# EAGLE design Naninator and Badger (EAGLE 6.2)
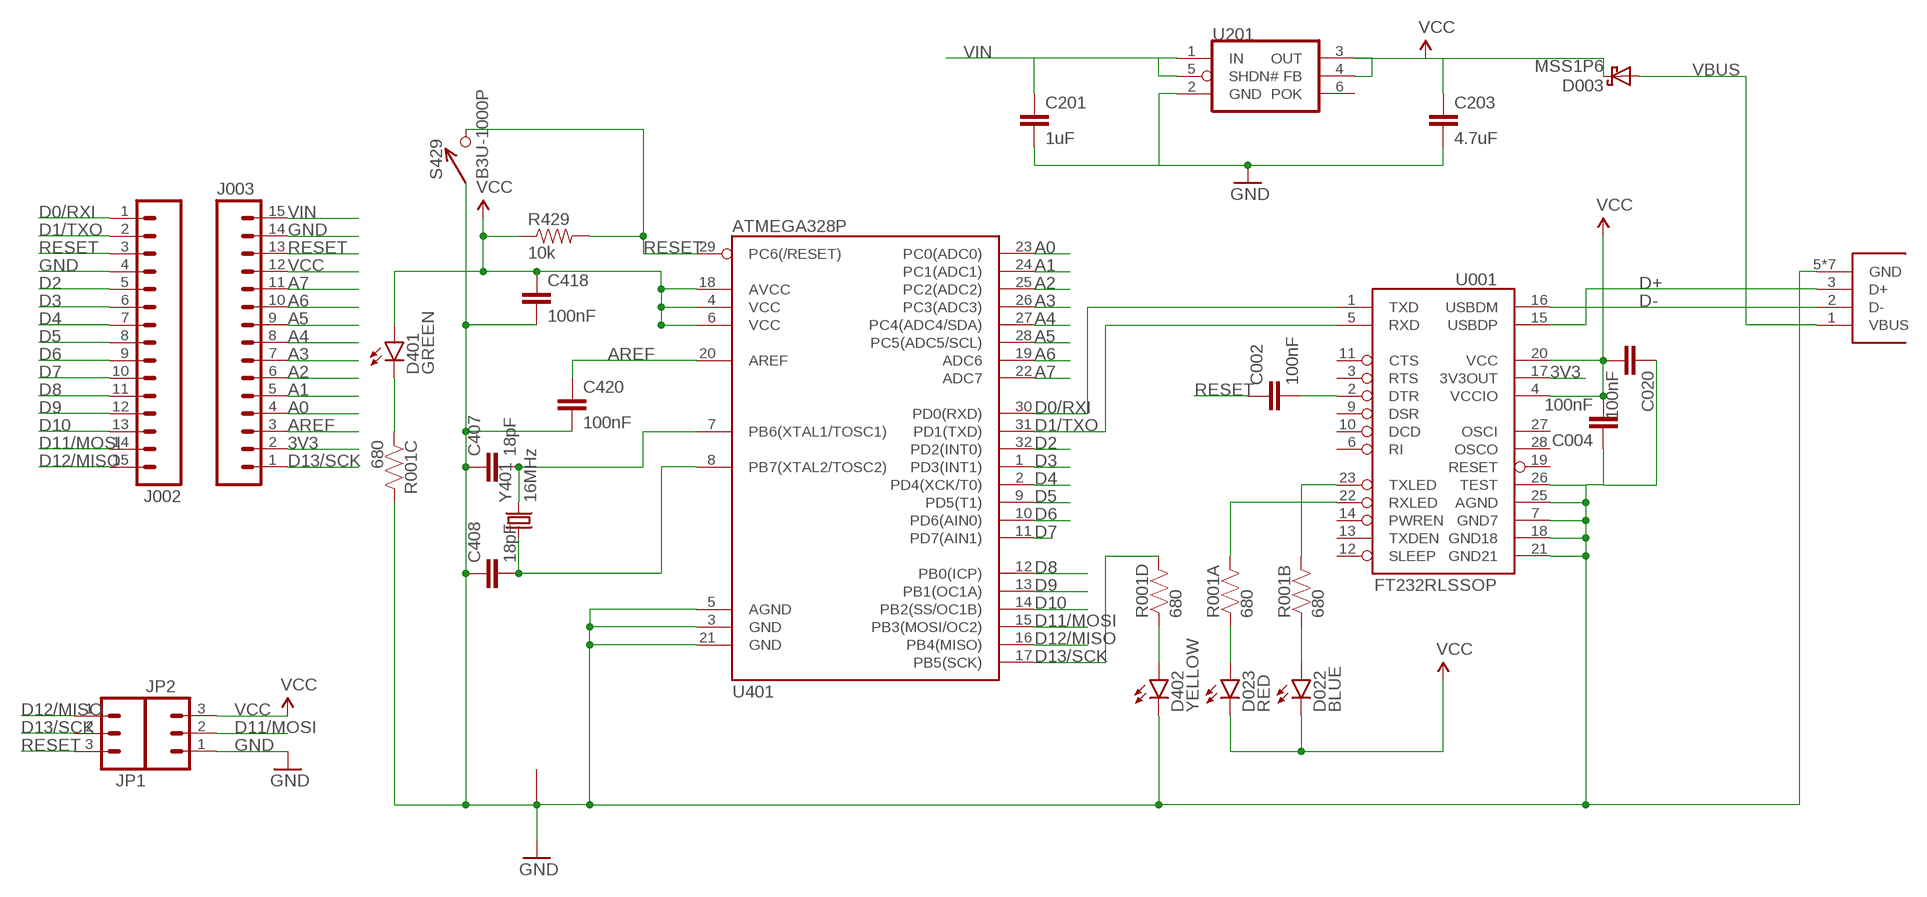
[diagram p0: schematic, sheet 1]

## Parts
C002  100nF  CAP0402-CAP  [0402-CAP]
C004  100nF  CAP0402-CAP  [0402-CAP]
C020  100nF  CAP0402-CAP  [0402-CAP]
C201  1uF  CAP0402-CAP  [0402-CAP]
C203  4.7uF  CAP0402-CAP  [0402-CAP]
C407  18pF  CAP0402-CAP  [0402-CAP]
C408  18pF  CAP0402-CAP  [0402-CAP]
C418  100nF  CAP0402-CAP  [0402-CAP]
C420  100nF  CAP0402-CAP  [0402-CAP]
D003  MSS1P6  [MICROSMP]
D022  BLUE  LED0603  [LED-0603]
D023  RED  LED0603  [LED-0603]
D401  GREEN  LED0603  [LED-0603]
D402  YELLOW  LED0603  [LED-0603]
J001  USB_MICROB_JSTFCI  [USB-MICROB-CONN-09505]
J002  M15  [1X15]
J003  M15  [1X15]
JP1  M03PTH  [1X03]
JP2  M03PTH  [1X03]
R001  680  RP404  [CRA04]
R429  10k  RESISTOR0402-RES  [0402-RES]
S429  B3U-1000P  [B3U-1000P]
U001  FT232RLSSOP  [SSOP28DB@1]
U201  MAX8881  [SOT-23-6]
U401  ATMEGA328P  ATMEGA168  [TQFP32-08@1]
Y401  16MHz  CX2520  [CRYSTAL_SMD_2MM_2_5MM]

## Nets
3V3: J003.2 U001.17(3V3OUT)
A0: J003.4 U401.23(PC0(ADC0))
A1: J003.5 U401.24(PC1(ADC1))
A2: J003.6 U401.25(PC2(ADC2))
A3: J003.7 U401.26(PC3(ADC3))
A4: J003.8 U401.27(PC4(ADC4/SDA))
A5: J003.9 U401.28(PC5(ADC5/SCL))
A6: J003.10 U401.19(ADC6)
A7: J003.11 U401.22(ADC7)
AREF: C420.1 J003.3 U401.20(AREF)
D0/RXI: J002.1 U001.1(TXD) U401.30(PD0(RXD))
D1/TXO: J002.2 U001.5(RXD) U401.31(PD1(TXD))
D2: J002.5 U401.32(PD2(INT0))
D3: J002.6 U401.1(PD3(INT1))
D4: J002.7 U401.2(PD4(XCK/T0))
D5: J002.8 U401.9(PD5(T1))
D6: J002.9 U401.10(PD6(AIN0))
D7: J002.10 U401.11(PD7(AIN1))
D8: J002.11 U401.12(PB0(ICP))
D9: J002.12 U401.13(PB1(OC1A))
D10: J002.13 U401.14(PB2(SS/OC1B))
D11/MOSI: J002.14 JP2.2 U401.15(PB3(MOSI/OC2))
D12/MISO: J002.15 JP1.1 U401.16(PB4(MISO))
D13/SCK: J003.1 JP1.2 R001.5 U401.17(PB5(SCK))
D+: J001.3(D+) U001.15(USBDP)
D-: J001.2(D-) U001.16(USBDM)
DTR#: C002.2 U001.2(DTR)
GND: C004.1 C020.1 C201.2 C203.2 C407.1 C408.1 C418.2 C420.2 D402.C J001.5(GND) J001.P1(GND) J001.P2(GND) J001.P3(GND) J001.P4(GND) J001.P5(GND) J001.P6(GND) J002.4 J003.14 JP2.1 R001.6 S429.P$1 U001.7(GND7) U001.18(GND18) U001.21(GND21) U001.25(AGND) U001.26(TEST) U201.2(GND) U401.3(GND) U401.5(AGND) U401.21(GND) Y401.2 Y401.4
N$1: C407.2 U401.7(PB6(XTAL1/TOSC1)) Y401.3
N$2: C408.2 U401.8(PB7(XTAL2/TOSC2)) Y401.1
N$3: D401.C R001.3
N$4: D022.A R001.2
N$5: D023.A R001.1
N$8: D402.A R001.4
RESET: C002.1 J002.3 J003.13 JP1.3 R429.2 S429.P$2 U401.29(PC6(/RESET))
RXLED1: R001.8 U001.22(RXLED)
TXLED1: R001.7 U001.23(TXLED)
VBUS: D003.A J001.1(VBUS)
VCC: C004.2 C020.2 C203.1 C418.1 D003.K D022.C D023.C D401.A J003.12 JP2.3 R429.1 U001.4(VCCIO) U001.20(VCC) U201.3(OUT) U201.4(FB) U401.4(VCC) U401.6(VCC) U401.18(AVCC)
VIN: C201.1 J003.15 U201.1(IN) U201.5(SHDN#)
Unconnected: U001.3(RTS) U001.6(RI) U001.9(DSR) U001.10(DCD) U001.11(CTS) U001.12(SLEEP) U001.13(TXDEN) U001.14(PWREN) U001.19(RESET) U001.27(OSCI) U001.28(OSCO) U201.6(POK)

## Library data of the parts
C002 C004 C020 C418 C420 = SparkFun:CAP: Capacitor Standard 0603 ceramic capacitor, and 0.1" leaded capacitor.; DIGIKEY: 445-1268-1-ND
C201 = SparkFun:CAP: Capacitor Standard 0603 ceramic capacitor, and 0.1" leaded capacitor.; DIGIKEY: 445-1415-1-ND
C203 = SparkFun:CAP: Capacitor Standard 0603 ceramic capacitor, and 0.1" leaded capacitor.; DIGIKEY: 445-7395-1-ND
C407 C408 = SparkFun:CAP: Capacitor Standard 0603 ceramic capacitor, and 0.1" leaded capacitor.; DIGIKEY: 445-1238-1-ND
D003 = KwanSystems:MSS1P6; DIGIKEY: MSS1P6-M3/89AGICT-ND
D022 = SparkFun-LED:LED: LEDs Standard schematic elements and footprints for 5mm, 3mm, 1206, and 0603 sized LEDs. 5mm - Spark Fun Electronics SKU : COM-00529 (and others); DIGIKEY: 350-2037-1-ND
D023 = SparkFun-LED:LED: LEDs Standard schematic elements and footprints for 5mm, 3mm, 1206, and 0603 sized LEDs. 5mm - Spark Fun Electronics SKU : COM-00529 (and others); DIGIKEY: 754-1359-1-ND
D401 = SparkFun-LED:LED: LEDs Standard schematic elements and footprints for 5mm, 3mm, 1206, and 0603 sized LEDs. 5mm - Spark Fun Electronics SKU : COM-00529 (and others); DIGIKEY: 350-2036-1-ND
D402 = SparkFun-LED:LED: LEDs Standard schematic elements and footprints for 5mm, 3mm, 1206, and 0603 sized LEDs. 5mm - Spark Fun Electronics SKU : COM-00529 (and others); DIGIKEY: 754-1124-1-ND
J001 = KwanSystems:USB_MICROB_JST; DIGIKEY: 455-2562-1-ND
J002 J003 = SparkFun-Connectors:M15: Header 15 Standard 15-pin 0.1" header. Use with straight break away headers (SKU : PRT-00116), right angle break away headers (PRT-00553), swiss pins (PRT-00743), machine pins (PRT-00117), and female headers (PRT-00115).; DIGIKEY: $NOPART
JP1 JP2 = SparkFun-Connectors:M03: Header 3 Standard 3-pin 0.1" header. Use with straight break away headers (SKU : PRT-00116), right angle break away headers (PRT-00553), swiss pins (PRT-00743), machine pins (PRT-00117), and female headers (PRT-00115). Molex polarized connector foot print use with SKU : PRT-08232 with associated crimp pins and housings.; DIGIKEY: $NOPART
R001 = KwanSystems:RP4; DIGIKEY: CRA4S8680CT-ND
R429 = SparkFun-Passives:RESISTOR: Resistor Basic schematic elements and footprints for 0603, 1206, and PTH resistors.; DIGIKEY: P10.0KLCT-ND
S429 = KwanSystems:B3U-1000P
U001 = SparkFun-DigitalIC:FT232RL: USB UART FT232RL 4th Generation USB UART (USB <-> Serial) Controller. Spark Fun Electronics SKU : COM-00650; DIGIKEY: 768-1007-1-ND
U201 = KwanSystems:MAX8881; DIGIKEY: MAX8881EUT50+TCT-ND
U401 = SparkFun-DigitalIC:ATMEGA168: Atmel 32-pin 8-bit micro, 16k flash.; DIGIKEY: ATMEGA328P-15AZCT-ND
Y401 = KwanSystems:CX2520; DIGIKEY: 478-6955-1-ND

## Net classes
0 default: width 0.152 mm, drill 0.33 mm, clearance 0.152 mm

## Board
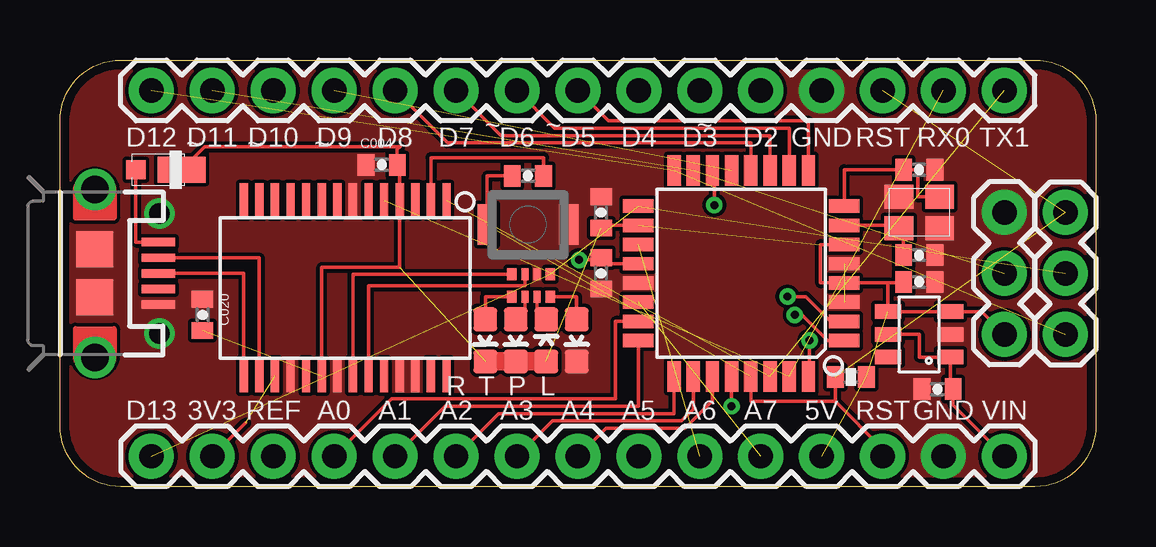
[diagram p1: board, top side]
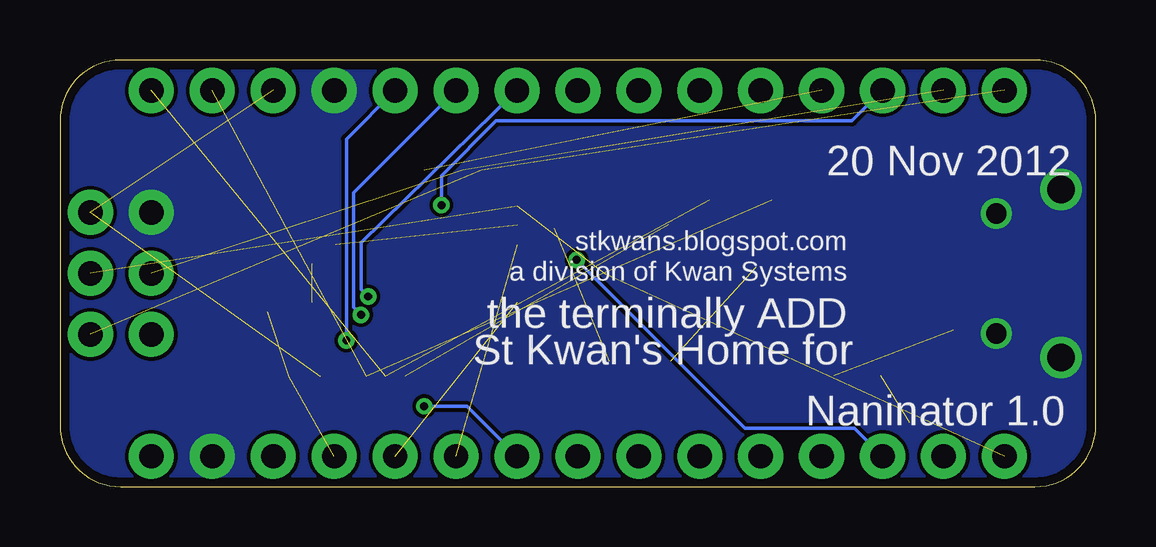
[diagram p2: board, bottom side, seen from below]

Size 43.18 x 17.78 mm. Coordinates in mm from the lower left corner, seen from the top.
Outline: 2.54,17.78 40.64,17.78 arc-90 43.18,15.24 43.18,2.54 arc-90 40.64,0 2.54,0 arc-90 0,2.54 0,15.24 arc-90 2.54,17.78
Copper layers (1*16): Top 0.0356mm / dielectric 1.5011mm / Bottom 0.0356mm
Design rules: minimum track width 6mil, minimum drill 13mil, track to track 6mil, track to pad 6mil, pad to pad 6mil, via to via 6mil, smd to smd 6mil, copper to edge 15mil, drill to drill 6mil, minimum pad ring 7mil, minimum via ring 7mil, stop-mask expansion 4mil, vias tented up to drill 14mil, thermal gap 10mil

### Footprints (pad centres in the part's own frame; a part is rotated, then mirrored left to right if it is on the bottom)
0402-CAP = smd 0.7 x 0.9: 1 -0.65,0; 2 0.65,0
MICROSMP = smd 0.8 x 0.8: A 0.9,0 | smd 2 x 1.1: K -1,0
LED-0603 = smd 1 x 1: A 0,-0.877; C 0,0.877
USB-MICROB-CONN-09505 = smd 0.35 x 1.4: 1 -1.3,4.1; 2 -0.65,4.1; 3 0,4.1; 4 0.65,4.1; 5 1.3,4.1 | smd 1.5 x 1.55: P1 -1,1.45; P2 1,1.45 | drill 1.15 pad 1.422: P3 -3.5,1.45; P4 3.5,1.45 | drill 0.85 pad 1.27: P5 -2.5,4.15; P6 2.5,4.15
1X15 = drill 1.016 pad 1.88: 1 0,0; 2 2.54,0; 3 5.08,0; 4 7.62,0; 5 10.16,0; 6 12.7,0; 7 15.24,0; 8 17.78,0; 9 20.32,0; 10 22.86,0; 11 25.4,0; 12 27.94,0; 13 30.48,0; 14 33.02,0; 15 35.56,0
1X03 = drill 1.016 pad 1.88: 1 0,0; 2 2.54,0; 3 5.08,0
CRA04 = smd 0.4 x 0.5: 1 -0.8,-0.475; 4 0.8,-0.475; 5 0.8,0.475; 8 -0.8,0.475 | smd 0.3 x 0.5: 2 -0.25,-0.475; 3 0.25,-0.475; 6 0.25,0.475; 7 -0.25,0.475
0402-RES = smd 0.7 x 0.9: 1 -0.65,0; 2 0.65,0
B3U-1000P = smd 0.8 x 1.7: P$1 -1.7,0; P$2 1.7,0
SSOP28DB = smd 0.348 x 1.397: 1 -4.225,-3.656; 2 -3.575,-3.656; 3 -2.925,-3.656; 4 -2.275,-3.656; 5 -1.625,-3.656; 6 -0.975,-3.656; 7 -0.325,-3.656; 8 0.325,-3.656; 9 0.975,-3.656; 10 1.625,-3.656; 11 2.275,-3.656; 12 2.925,-3.656; 13 3.575,-3.656; 14 4.225,-3.656; 15 4.225,3.656; 16 3.575,3.656; 17 2.925,3.656; 18 2.275,3.656; 19 1.625,3.656; 20 0.975,3.656; 21 0.325,3.656; 22 -0.325,3.656; 23 -0.975,3.656; 24 -1.625,3.656; 25 -2.275,3.656; 26 -2.925,3.656; 27 -3.575,3.656; 28 -4.225,3.656
SOT-23-6 = smd 0.6 x 1.1: 1 -0.95,-1.3; 2 0,-1.3; 3 0.95,-1.3; 4 0.95,1.3; 5 0,1.3; 6 -0.95,1.3
TQFP32-08 = smd 1.27 x 0.559: 1 -4.293,2.8; 2 -4.293,2; 3 -4.293,1.2; 4 -4.293,0.4; 5 -4.293,-0.4; 6 -4.293,-1.2; 7 -4.293,-2; 8 -4.293,-2.8; 17 4.293,-2.8; 18 4.293,-2; 19 4.293,-1.2; 20 4.293,-0.4; 21 4.293,0.4; 22 4.293,1.2; 23 4.293,2; 24 4.293,2.8 | smd 0.559 x 1.27: 9 -2.8,-4.293; 10 -2,-4.293; 11 -1.2,-4.293; 12 -0.4,-4.293; 13 0.4,-4.293; 14 1.2,-4.293; 15 2,-4.293; 16 2.8,-4.293; 25 2.8,4.293; 26 2,4.293; 27 1.2,4.293; 28 0.4,4.293; 29 -0.4,4.293; 30 -1.2,4.293; 31 -2,4.293; 32 -2.8,4.293
CRYSTAL_SMD_2MM_2_5MM = smd 1.2 x 1: 1 -0.85,-0.65; 2 0.85,-0.65; 3 0.85,0.65; 4 -0.85,0.65

### Placement (x,y rotation side)
C002  19.51,12.95 0 top
C004  13.41,13.41 0 top
C020  5.94,7.16 270 top
C201  36.58,4.06 180 top
C203  35.81,8.53 0 top
C407  35.81,9.65 180 top
C408  35.81,13.21 180 top
C418  22.56,11.43 90 top
C420  22.56,8.89 270 top
D003  4.06,13.21 180 top
D022  19,6.1 180 top
D023  17.73,6.1 180 top
D401  20.27,6.1 0 top
D402  21.54,6.1 180 top
J001  0,8.89 270 top
J002  39.37,16.51 180 top
J003  3.81,1.27 0 top
JP1  41.91,6.35 90 top
JP2  39.37,11.43 270 top
R001  19.63,8.38 0 top
R429  32.97,4.57 180 top
S429  19.51,10.92 180 top
U001  FT232RLSSOP  [SSOP28DB]  11.89,8.28 180 top
U201  35.81,6.35 90 top
U401  ATMEGA328P  [TQFP32-08]  28.4,8.89 180 top
Y401  35.81,11.43 180 top

### Tracks (layer width: path | path; a pad name or v marks a point on that pad's centre or on a via)
3V3  (1 unrouted)
  Top 0.152: J003.2 7.74,2.66
A0
  Top 0.152: U401.23 23.16,6.89 23.16,3.66 13.82,3.66 J003.4
A1
  Top 0.152: 24.11,5.61 U401.24 24.11,3.35 16.05,3.35 J003.5
A2
  Top 0.152: U401.25 25.6,3.05 18.29,3.05 J003.6
A3
  Top 0.152: J003.7 20.52,2.74 25.91,2.74 26.4,3.23 U401.26
A4
  Top 0.152: U401.27 27.2,3.58 26.06,2.44 22.76,2.44 J003.8
A5  (via drill 0.33)
  Top 0.152: U401.28 v28,3.35
  Bottom 0.152: v28,3.35 26.21,3.35 J003.9
A6  (1 unrouted)
A7  (1 unrouted)
AREF  (via drill 0.33)
  Top 0.152: U401.20 22.81,9.29 arc90 C420.1 arc-90 22.46,9.45 v21.64,9.45
  Bottom 0.152: v21.64,9.45 14.63,2.44 10.06,2.44 J003.3
D0/RXI  (2 unrouted)
D1/TXO  (2 unrouted)
D2  (via drill 0.33)
  Top 0.152: v31.24,6.1 31.24,4.6 U401.32
  Bottom 0.152: J002.5 31.24,14.48 v31.24,6.1
D3  (via drill 0.33)
  Top 0.152: v30.63,7.16 30.94,7.16 32.01,6.09 U401.1
  Bottom 0.152: J002.6 30.94,12.24 30.94,7.47 v30.63,7.16
D4  (via drill 0.33)
  Top 0.152: v30.33,7.92 31.09,7.92 32.16,6.86 32.66,6.86 U401.2
  Bottom 0.152: J002.7 30.63,10.16 30.63,8.23 v30.33,7.92
D5
  Top 0.152: J002.8 22.86,15.24 31.2,15.24 U401.9
D6
  Top 0.152: J002.9 20.62,14.94 30.4,14.94 U401.10
D7
  Top 0.152: J002.10 18.39,14.63 29.6,14.63 U401.11
D8
  Top 0.152: J002.11 16.15,14.33 28.8,14.33 U401.12
D9  (1 unrouted)
D10  (via drill 0.33)
  Top 0.152: v27.28,11.73 27.28,13.18 U401.14
  Bottom 0.152: J002.13 10.16,15.24 24.99,15.24 27.28,12.95 v27.28,11.73
D11/MOSI  (2 unrouted)
D12/MISO  (2 unrouted)
D13/SCK  (3 unrouted)
D+
  Top 0.152: J001.3 7.66,8.89 U001.15
D-
  Top 0.152: J001.2 8.31,9.54 U001.16
DTR#
  Top 0.152: C002.2 20.16,13.72 15.46,13.72 U001.2
GND  (1 unrouted)
  pour Top (no thermals): 2.54,17.78 40.64,17.78 arc-90 43.18,15.24 43.18,2.54 arc-90 40.64,0 2.54,0 arc-90 0,2.54 0,15.24 arc-90
  pour Bottom (no thermals): 2.54,17.78 40.64,17.78 arc-90 43.18,15.24 43.18,2.54 arc-90 40.64,0 2.54,0 arc-90 0,2.54 0,15.24 arc-90
N$1
  Top 0.152: U401.7 34.85,10.89 arc-90 Y401.3 35.16,10.78 C407.2
N$2
  Top 0.152: Y401.1 35.76,12.08 35.76,13.21 C408.2 32.69,13.21 U401.8
N$3
  Top 0.152: R001.3 19.88,7.36 D401.C
N$4
  Top 0.152: D022.A arc90 19.38,7.36 R001.2
N$5
  Top 0.152: D023.A 17.73,7.91 R001.1
N$8
  Top 0.152: R001.4 21.54,7.91 D402.A
RESET  (3 unrouted)
  Top 0.152: S429.P$2 17.81,12.95 C002.1 | R429.2 32.32,3.56 | 32.32,3.56 28.8,3.56 U401.29 | 32.32,3.56 34.29,1.58 J003.13
RXLED1
  Top 0.152: U001.22 12.21,8.86 R001.8
TXLED1
  Top 0.152: U001.23 12.86,8.38 19.38,8.38 R001.7
VBUS
  Top 0.152: D003.A 3.16,10.19 J001.1
VCC  (6 unrouted)
  Top 0.152: C418.1 22.66,10.89 U401.18 | JP2.3 38.42,7.3 U201.3 U201.4 34.51,8.49 | U401.6 31.7,10.09 31.7,8.49 U401.4 34.51,8.49 | 34.51,8.49 35.16,8.49 C203.1 | U001.20 10.91,9.14 14.16,9.14 U001.4 14.16,13.31 C004.2 14.06,14.06 14.17,14.17 6.03,14.17 D003.K
  Top 0.762: D401.A D022.C D023.C
VIN
  Top 0.152: U201.5 35.81,6.35 35.81,5.4 U201.1 37.11,4.06 C201.1 37.23,3.41 J003.15

### Text on the board
tPlace: D12 | ~ | D11 | ~ | D10 | ~ | D9 | D8 | D7 | ~ | D6 | ~ | D5 | D4 | D3 | ~ | D2 | GND | RST | RX0 | TX1 | R | T | P | L | D13 | 3V3 | REF | A0 | A1 | A2 | A3 | A4 | A5 | A6 | A7 | 5V | RST | GND | VIN
bPlace: 20 Nov 2012 | stkwans.blogspot.com | a division of Kwan Systems | the terminally ADD | St Kwan's Home for | Naninator 1.0